# EasyEDA Pro project OpenEarable-PCB-flex-2.0.epro

# Schematic OpenEarable - Earpiece v2.7 - Schematic
Create Date: 2025-03-28; Page Name: OpenEarable - Earpiece v2.5 - Schematic; Project Name: OpenEarable - Earpiece v2.7; Schematic Name: OpenEarable - Earpiece v2.7 - Schematic; Update Date: 2025-03-28; Company: Karlsruhe Institute of Technology; Page Size: A4; Version: V2.0
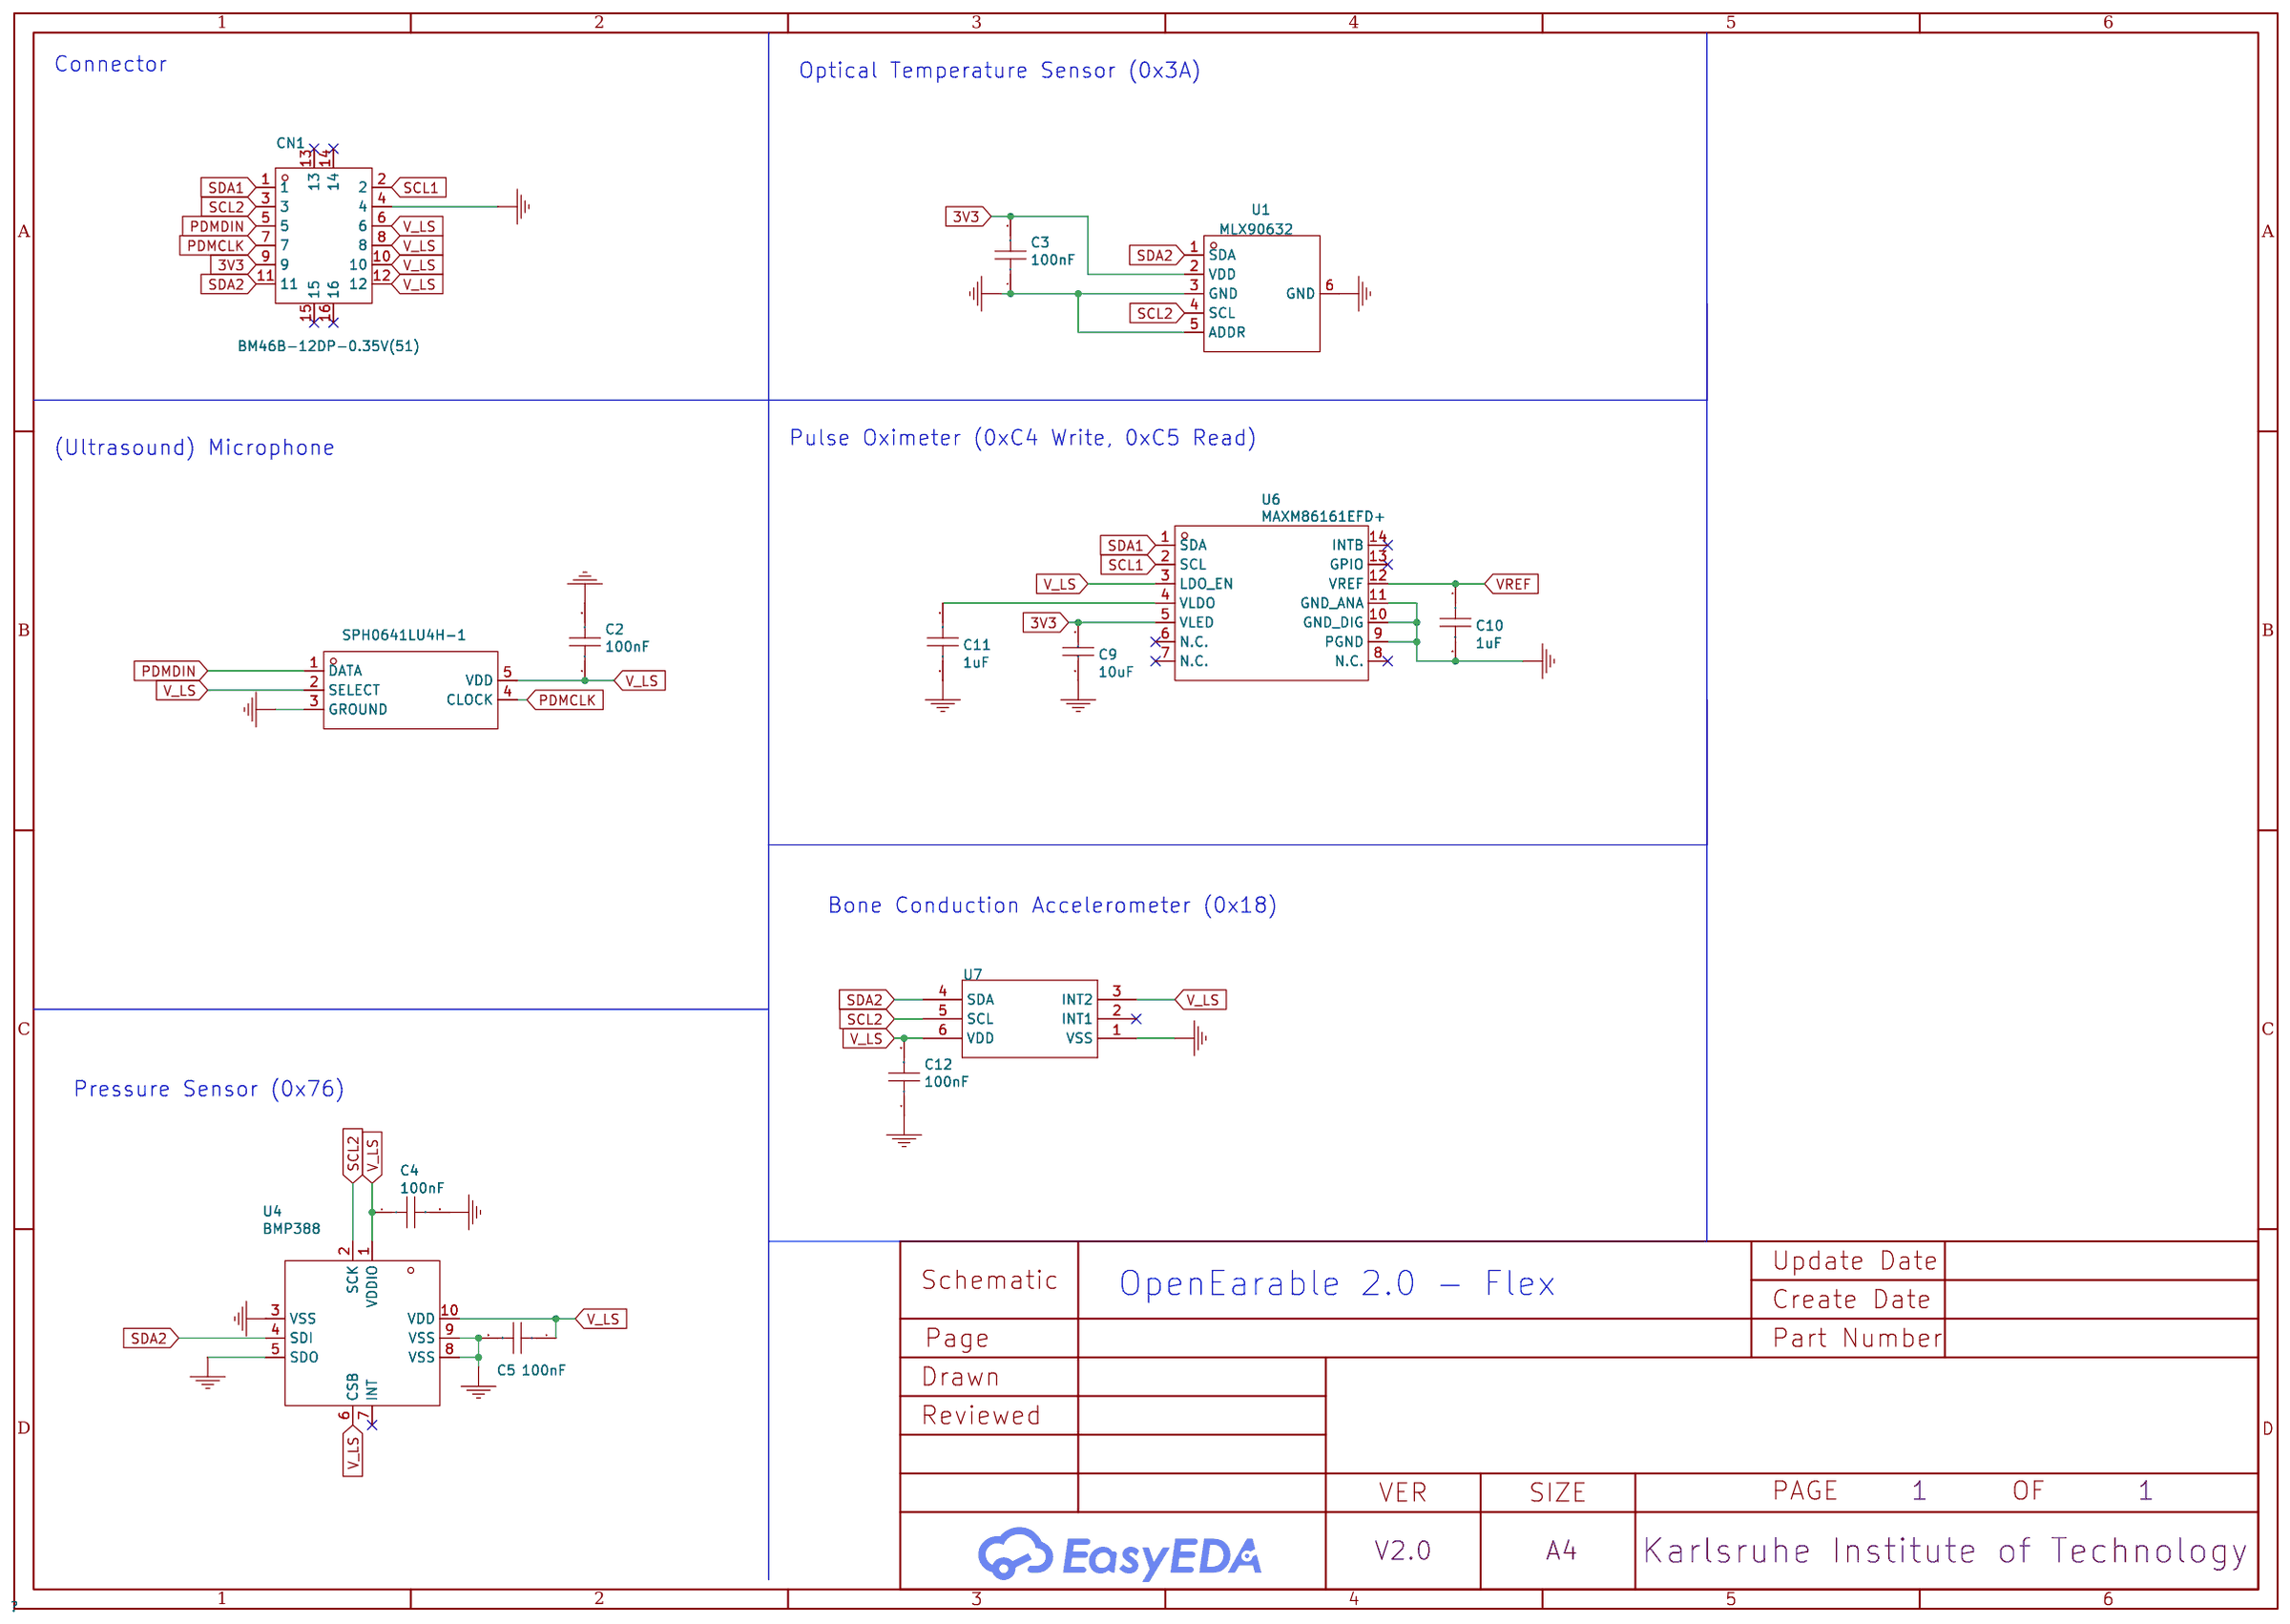
[diagram p0: schematic sheet]

## Parts
C2  100nF  [C0201]
C3  100nF  [C0201]
C4  100nF  [C0201]
C5  100nF  [C0201]
C9  10uF  [C0402]
C10  1uF  [C0201]
C11  1uF  [C0201]
C12  100nF  [C0201]
CN1  BM46B-12DP-0.35V(51)  [CONN-SMD_12P-P0.35_BM46B-12DP-0.35V-51]
U1  MLX90632  [SENSOR-SMD_MLX90632]
U3  SPH0641LU4H-1  [MIC-SMD_5P_L3.5-W2.7-P0.82_SPH0641LU4H-1]
U4  BMP388  [SENSORM-SMD_BMP388]
U6  MAXM86161EFD+  [OLGA-14_L4.3-W2.9-P0.60-TL]
U7  -  [BMA580]

## Library data of the parts
C2-C5 C12 = 100nF: Supplier: LCSC; Supplier Part: C2903664; Manufacturer: CCTC(三环); Manufacturer Part: TCC0201X5R104M6R3ZT
C9 = 10uF: Supplier: LCSC; Manufacturer Part: CL05A106MQ5NUNC; Manufacturer: SAMSUNG(三星); Supplier Part: C15525; JLCPCB Part Class: Basic Part
C10 C11 = 1uF: Supplier: LCSC; Supplier Part: C466604; Manufacturer: SANYEAR(叁叶源); Manufacturer Part: C0201X5R105M6R3NT
CN1 = BM46B-12DP-0.35V(51): Number of Pins:- Pitch:0.35mm Mounting Style:Standing paste Number of Rows:2 Contact Plating:Gold; LCSC Part Name: 间距:0.35mm 公 立贴; Supplier Part: C3642308; Manufacturer: HRS(广濑); Supplier Footprint: SMD,P=0.35mm; JLCPCB Part Class: Extended Part; Datasheet: https://atta.szlcsc.com/upload/public/pdf/source/20241025/0C5D3304AC55DC1CF00DB95F558A8B79.pdf; Supplier: LCSC; Pitch: 0.35mm; Mounting Style: Standing paste; Number of Rows: 2; Contact Plating: Gold
U1 = MLX90632: Supplier: LCSC; Supplier Part: C9900018399; Manufacturer: null; JLCPCB Part Class: Extended Part; link: https://lcsc.com/eda_search?q=C9900018399&amp;%26type=1&amp;ref=editor
U3 = SPH0641LU4H-1: Supplier: LCSC; Supplier Part: C2879853; Manufacturer: null; Manufacturer Part: sph0641lu4h-1; JLCPCB Part Class: Extended Part
U4 = BMP388: Supplier: LCSC; Supplier Part: C779278; Manufacturer: Bosch(博世); JLCPCB Part Class: Extended Part
U6 = MAXM86161EFD+: Supplier: LCSC; Supplier Part: C1530834; Manufacturer: MAXIM(美信); JLCPCB Part Class: Extended Part
U7 = BMA580

## Nets
3V3: C3.2 C9.1 CN1.9 U1.2(VDD) U6.5(VLED)
GND: C2.2 C3.1 C4.2 C5.2 C9.2 C10.2 C11.2 C12.1 CN1.4 U1.3(GND) U1.5(ADDR) U1.6(GND) U3.3(GROUND) U4.3(VSS) U4.5(SDO) U4.8(VSS) U4.9(VSS) U6.9(PGND) U6.10(GND_DIG) U6.11(GND_ANA) U7.1(VSS)
PDMCLK: CN1.7 U3.4(CLOCK)
PDMDIN: CN1.5 U3.1(DATA)
SCL1: CN1.2 U6.2(SCL)
SCL2: CN1.3 U1.4(SCL) U4.2(SCK) U7.5(SCL)
SDA1: CN1.1 U6.1(SDA)
SDA2: CN1.11 U1.1(SDA) U4.4(SDI) U7.4(SDA)
V_LS: C2.1 C4.1 C5.1 C12.2 CN1.6 CN1.8 CN1.10 CN1.12 U3.2(SELECT) U3.5(VDD) U4.1(VDDIO) U4.6(CSB) U4.10(VDD) U6.3(LDO_EN) U7.3(INT2) U7.6(VDD)
VREF: C10.1 U6.12(VREF)
$1N972: C11.1 U6.4(VLDO)

Not connected (* = marked no-connect by the designer): CN1 13* 14* 15* 16*; U4 7(INT)*; U6 6(N.C.)* 7(N.C.)* 8(N.C.)* 13(GPIO)* 14(INTB)*; U7 2(INT1)*

## Notes on the sheet
- Connector
- Optical Temperature Sensor (0x3A)
- (Ultrasound) Microphone
- Pulse Oximeter (0xC4 Write, 0xC5 Read)
- Bone Conduction Accelerometer (0x18)
- Pressure Sensor (0x76)
- OpenEarable 2.0 - Flex

# Board OpenEarable - Earpiece v2.7 - Layout
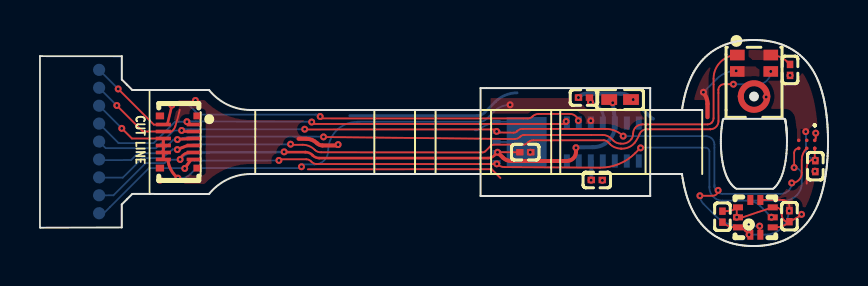
[diagram p1: board, top side]
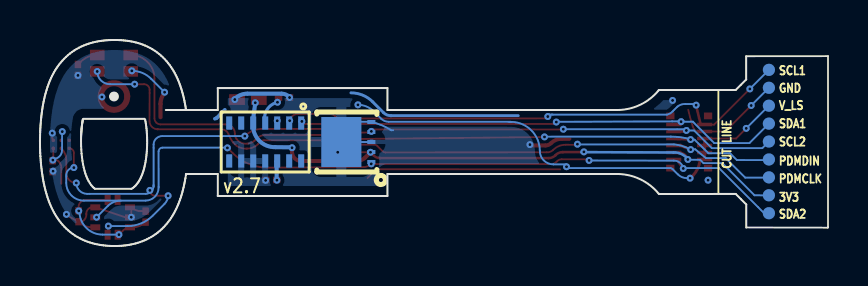
[diagram p2: board, bottom side, seen from below]

Outline 39.42 x 10.31 mm; copper layers: Top Layer, Bottom Layer. Coordinates in mm from the lower left corner of the outline.
Outline path: 5.48,7.8 6.84,7.8 ; 8.46,2.6 6.16,2.6 5.48,2.6 4.62,2.6 4.09,2.08 4.09,0.93 0.02,0.92 0,0.93 0,9.5 4.09,9.5 4.09,8.33 4.62,7.8 8.46,7.8 8.48,7.78 arc(9.4,7.06) 10.54,6.8 22.04,6.8 22.04,7.9 30.53,7.9 30.53,6.8 33.13,6.8 ; 8.45,2.6 8.47,2.62 arc(9.4,3.34) 10.54,3.6 22.04,3.6 22.04,2.5 30.53,2.5 30.53,3.6 32.11,3.6 32.13,3.53 32.12,3.6 ; 32.12,6.8 32.13,6.88 32.14,6.95 32.15,7.03 32.17,7.11 32.18,7.19 32.2,7.27 32.22,7.35 32.24,7.43 32.25,7.51 32.28,7.59 32.3,7.68 32.32,7.76 32.35,7.84 32.37,7.93 32.4,8.01 32.44,8.1 32.47,8.19 32.5,8.28 32.54,8.37 32.59,8.47 32.63,8.56 32.68,8.66 32.74,8.75 32.8,8.85 32.86,8.94 32.93,9.04 33.01,9.14 33.09,9.24 33.17,9.34 33.27,9.43 33.36,9.52 33.46,9.61 33.57,9.69 33.68,9.77 33.8,9.84 33.91,9.91 34.04,9.97 34.16,10.03 34.28,10.07 34.4,10.12 34.51,10.15 34.62,10.18 34.73,10.21 34.84,10.23 34.95,10.25 35.05,10.27 35.15,10.28 35.24,10.29 35.34,10.3 35.43,10.3 35.52,10.3 35.62,10.31 35.71,10.31 35.8,10.31 35.89,10.3 35.98,10.3 36.07,10.29 36.17,10.29 36.26,10.28 36.36,10.26 36.46,10.25 36.56,10.23 36.67,10.21 36.77,10.18 36.88,10.15 37,10.12 37.11,10.08 37.23,10.03 37.34,9.98 37.47,9.92 37.59,9.86 37.7,9.79 37.81,9.71 37.92,9.63 38.02,9.55 38.12,9.46 38.21,9.37 38.3,9.28 38.39,9.18 38.47,9.08 38.54,8.98 38.6,8.88 38.66,8.79 38.72,8.69 38.77,8.6 38.82,8.5 38.87,8.41 38.91,8.32 38.95,8.23 38.98,8.14 39.01,8.05 39.04,7.96 39.07,7.88 39.1,7.79 39.12,7.71 39.15,7.62 39.17,7.54 39.19,7.46 39.21,7.38 39.23,7.3 39.24,7.22 39.26,7.14 39.27,7.06 39.29,6.98 39.3,6.9 39.31,6.82 39.32,6.75 39.34,6.6 39.35,6.52 39.36,6.45 39.37,6.3 39.39,6.15 39.39,6.08 39.4,6 39.4,5.93 39.41,5.78 39.41,5.71 39.42,5.56 39.42,5.42 39.42,5.39 39.42,5.34 39.42,5.28 39.42,5.22 39.42,5.06 39.42,4.98 39.42,4.83 39.41,4.75 39.41,4.67 39.4,4.51 39.39,4.36 39.39,4.28 39.38,4.2 39.37,4.04 39.36,3.96 39.35,3.88 39.34,3.8 39.33,3.72 39.32,3.64 39.31,3.56 39.29,3.48 39.28,3.4 39.27,3.31 39.25,3.23 39.23,3.15 39.22,3.06 39.2,2.97 39.18,2.89 39.15,2.8 39.13,2.71 39.1,2.63 39.08,2.54 39.05,2.45 39.02,2.36 38.99,2.26 38.95,2.17 38.91,2.07 38.87,1.98 38.83,1.88 38.78,1.78 38.72,1.68 38.67,1.58 38.6,1.48 38.54,1.38 38.46,1.27 38.38,1.17 38.3,1.07 38.21,0.97 38.11,0.87 38.01,0.78 37.9,0.69 37.79,0.6 37.67,0.52 37.54,0.45 37.42,0.38 37.29,0.32 37.17,0.26 37.04,0.22 36.92,0.17 36.8,0.14 36.68,0.11 36.57,0.08 36.46,0.06 36.35,0.05 36.24,0.03 36.13,0.02 36.03,0.01 35.93,0.01 35.83,0 35.73,0 35.63,0 35.54,0 35.45,0.01 35.36,0.01 35.26,0.02 35.16,0.03 35.06,0.04 34.96,0.06 34.86,0.08 34.75,0.1 34.64,0.13 34.53,0.16 34.42,0.2 34.3,0.24 34.19,0.28 34.08,0.33 33.97,0.39 33.86,0.45 33.75,0.52 33.65,0.59 33.54,0.67 33.44,0.75 33.34,0.84 33.24,0.93 33.16,1.02 33.08,1.12 33,1.21 32.94,1.3 32.87,1.39 32.81,1.49 32.76,1.58 32.7,1.67 32.66,1.76 32.61,1.85 32.57,1.94 32.53,2.03 32.5,2.11 32.46,2.2 32.43,2.28 32.4,2.37 32.37,2.45 32.35,2.53 32.32,2.61 32.3,2.69 32.28,2.77 32.26,2.85 32.24,2.93 32.22,3.01 32.21,3.08 32.19,3.16 32.18,3.23 32.16,3.31 32.15,3.38 32.14,3.46 ; 34.06,5.23 34.06,5.13 34.06,5.04 34.07,4.94 34.07,4.84 34.08,4.74 34.09,4.65 34.1,4.55 34.11,4.46 34.12,4.36 34.13,4.27 34.15,4.18 34.17,4.09 34.19,4 34.21,3.92 34.23,3.84 34.25,3.75 34.28,3.68 34.3,3.6 34.33,3.53 34.36,3.46 34.4,3.39 34.43,3.32 34.47,3.26 34.5,3.2 34.54,3.15 34.59,3.09 34.64,3.03 34.7,2.97 34.78,2.9 34.85,2.86 36.67,2.86 36.72,2.9 36.79,2.97 36.86,3.05 36.93,3.14 36.99,3.25 37.05,3.36 37.1,3.49 37.15,3.62 37.19,3.77 37.23,3.92 37.27,4.09 37.3,4.26 37.32,4.44 37.34,4.63 37.36,4.82 37.37,5.02 37.37,5.22 37.37,5.31 37.37,5.43 37.36,5.54 37.36,5.6 37.36,5.63 37.36,5.66 37.36,5.68 37.35,5.71 37.35,5.74 37.35,5.79 37.35,5.82 37.34,5.84 37.33,5.95 37.33,5.97 37.33,6.01 37.32,6.07 37.32,6.09 37.31,6.12 37.31,6.14 37.31,6.17 37.3,6.23 37.29,6.28 37.28,6.3 37.28,6.32 37.25,6.36 34.2,6.36 34.16,6.31 34.15,6.23 34.13,6.14 34.12,6.06 34.11,5.97 34.1,5.88 34.09,5.79 34.08,5.7 34.07,5.61 34.07,5.52 34.07,5.42 34.06,5.33 34.06,5.23
Stack: Top Layer 0.012mm / Dielectric1 0.025mm FR4 er 4.5 / Bottom Layer 0.012mm

## Design rules (mm)
template: Custom Config
spacing copperThickness1oz (default): track to track 0.077, other pairs 0.1 to 0.3
spacing copperThickness2oz: track to track 0.203, other pairs 0.152 to 0.3
track width copperThickness1oz (default): min 0.09, default 0.09, max 0.09
track width copperThickness2oz: min 0.203, default 0.254, max 2.54
differential pair differentialPair (default): width min 0.127, default 0.254, max 2.54; gap min 0.152, default 0.152
via viaSize (default): diameter min 0.35, default 0.35, max 0.35; hole min 0.15, default 0.15, max 0.15

## Placement (name value [footprint] x y rotation side)
C2  100nF  [C0201]  37.52 8.81 270 top
C3  100nF  [C0201]  24.28 4.7 180 top
C4  100nF  [C0201]  34.14 1.47 90 top
C5  100nF  [C0201]  37.49 1.49 270 top
C9  10uF  [C0402]  29.02 7.33 0 top
C10  1uF  [C0201]  27.85 3.3 0 top
C11  1uF  [C0201]  27.21 7.43 180 top
C12  100nF  [C0201]  38.79 3.99 90 top
CN1  BM46B-12DP-0.35V(51)  [CONN-SMD_12P-P0.35_BM46B-12DP-0.35V-51]  6.94 5.2 270 top
NOREF  -  [Pad_e529]  2.96 6.12 0 top
NOREF#2  -  [Pad_e534]  2.96 4.33 0 top
NOREF#3  -  [Pad_e535]  2.96 3.43 0 top
NOREF#4  -  [Pad_e533]  2.96 5.23 0 top
NOREF#5  -  [Pad_e531]  2.96 8.81 0 top
NOREF#6  -  [Pad_e528]  2.96 7.02 0 top
NOREF#7  -  [Pad_e536]  2.96 2.54 0 top
NOREF#8  -  [Pad_e537]  2.96 1.64 0 top
NOREF#9  -  [Pad_e524]  2.96 7.92 0 top
U1  MLX90632  [sensor-smd_mlx90632]  23.6 5.2 90 bottom
U3  SPH0641LU4H-1  [MIC-SMD_5P_L3.5-W2.7-P0.82_SPH0641LU4H-1]  35.72 8.19 0 top
U4  BMP388  [SENSORM-SMD_BMP388]  35.79 1.43 180 top
U6  MAXM86161EFD+  [olga-14_l4.3-w2.9-p0.60-tl]  28.16 5.2 270 bottom
U7  -  [BMA580]  38.36 5.09 0 top

## Footprints (pads in the part's own frame, mm; a bottom-side part is the same pattern mirrored in y, then rotated)
BMA580
  round 0.18 smd: 1(0.4,0.2) 2(0,0.2) 3(-0.4,0.2) 4(-0.4,-0.2) 5(0,-0.2) 6(0.4,-0.2)
C0201
  rect 0.368x0.324 smd: 1(-0.275,0) 2(0.275,0)
C0402
  rect 0.79x0.54 smd: 1(-0.545,0) 2(0.545,0)
CONN-SMD_12P-P0.35_BM46B-12DP-0.35V-51
  rect 0.18x0.755 smd: 1(-0.875,0.772) 2(-0.875,-0.772) 3(-0.525,0.772) 4(-0.525,-0.772) 5(-0.175,0.772) 6(-0.175,-0.772) 7(0.175,0.772) 8(0.175,-0.772) 9(0.525,0.772) 10(0.525,-0.772) 11(0.875,0.772) 12(0.875,-0.772)
  rect 0.34x0.415 smd: 13(1.305,0.943) 14(1.305,-0.943) 15(-1.305,0.943) 16(-1.305,-0.943)
MIC-SMD_5P_L3.5-W2.7-P0.82_SPH0641LU4H-1
  rect 0.73x0.53 smd: 1(-0.838,1.369) 2(-0.838,0.546) 4(0.838,0.546) 5(0.838,1.369)
  custom 1.626x0.963 smd: 3(0,-0.043)
  custom 1.626x0.966 smd: 6(0,-1.368)
olga-14_l4.3-w2.9-p0.60-tl
  rect 0.66x0.3 smd: 1(-0.95,1.8) 2(-0.95,1.2) 3(-0.95,0.6) 4(-0.95,0) 5(-0.95,-0.6) 6(-0.95,-1.2) 7(-0.95,-1.8) 8(0.95,-1.8) 9(0.95,-1.2) 10(0.95,-0.6) 11(0.95,0) 12(0.95,0.6) 13(0.95,1.2) 14(0.95,1.8)
Pad_e524
  round 0.61 smd far side: TP2(0,0)
Pad_e528
  round 0.61 smd far side: TP3(0,0)
Pad_e529
  round 0.61 smd far side: TP4(0,0)
Pad_e531
  round 0.61 smd far side: TP1(0,0)
Pad_e533
  round 0.61 smd far side: TP5(0,0)
Pad_e534
  round 0.61 smd far side: TP6(0,0)
Pad_e535
  round 0.61 smd far side: TP7(0,0)
Pad_e536
  round 0.61 smd far side: TP8(0,0)
Pad_e537
  round 0.61 smd far side: TP9(0,0)
sensor-smd_mlx90632
  rect 0.2x0.4 smd: 1(-1,-0.75) 2(-0.499,-0.75) 3(0,-0.75) 4(0.5,-0.75) 5(1,-0.75)
  rect 2.5x2 smd: 6(0,0.75)
SENSORM-SMD_BMP388
  rect 0.3x0.5 smd: 1(0.25,0.871) 2(-0.25,0.871) 6(-0.25,-0.871) 7(0.25,-0.871)
  rect 0.5x0.3 smd: 3(-0.87,0.5) 4(-0.87,0) 5(-0.87,-0.5) 8(0.869,-0.5) 9(0.869,0) 10(0.869,0.5)

## Nets
3V3: C3.2 C9.1 CN1.9 NOREF#7.TP8 U1.2 U6.5
GND: C2.2 C3.1 C4.2 C5.2 C9.2 C10.2 C11.2 C12.1 CN1.4 NOREF#9.TP2 U1.3 U1.5 U1.6 U3.3 U3.6 U4.3 U4.5 U4.8 U4.9 U6.9 U6.10 U6.11 U7.1
PDMCLK: CN1.7 NOREF#3.TP7 U3.4
PDMDIN: CN1.5 NOREF#2.TP6 U3.1
SCL1: CN1.2 NOREF#5.TP1 U6.2
SCL2: CN1.3 NOREF#4.TP5 U1.4 U4.2 U7.5
SDA1: CN1.1 NOREF.TP4 U6.1
SDA2: CN1.11 NOREF#8.TP9 U1.1 U4.4 U7.4
V_LS: C2.1 C4.1 C5.1 C12.2 CN1.6 CN1.8 CN1.10 CN1.12 NOREF#6.TP3 U3.2 U3.5 U4.1 U4.6 U4.10 U6.3 U7.3 U7.6
VREF: C10.1 U6.12
$1N972: C11.1 U6.4

Pads without a net: CN1 13 14 15 16; U4 7; U6 6 7 8 13 14; U7 2

## Via types
v1: diameter 0.35, hole 0.15, Top Layer to Bottom Layer, 59 vias

## Routing (per net, layer and track width the routed paths; a pad name or vN(x,y) marks a point on that pad's centre or on a via; arc(x,y) is an arc through that point)
3V3: length 31.2
  Top Layer w0.09: v1(22.89,4.69) 24,4.69 arc(24,4.69) C3.2
  Top Layer w0.127: 7.01,4.35 arc(7.21,4.59) 7.51,4.68 ; 12.25,4.7 13.31,4.7 ; 13.26,4.7 13.28,4.7 arc(13.46,4.66) 13.62,4.55 13.64,4.54 arc(13.79,4.43) 13.98,4.4 ; 13.97,4.4 22.42,4.4 arc(22.58,4.43) 22.72,4.53 v1(22.89,4.69)
  Top Layer w0.2: v1(22.89,4.69) 23.16,4.42 arc(23.35,4.3) 23.57,4.25 26.36,4.25 arc(26.68,4.39) 26.81,4.71 26.81,4.94
  Bottom Layer w0.09: 2.96,2.53 3.68,2.54 5.28,4.14 6.23,4.14 6.4,4.31 7.01,4.31
  Bottom Layer w0.127: 7.01,4.35 arc(7.34,4.6) 7.74,4.68 ; CN1.9 12.33,4.7
  Bottom Layer w0.2: 26.81,4.94 27.65,4.95 arc(28.48,5.29) U6.5 arc(28.73,6.28) 28.75,6.41 v1(28.65,7.17)
  vias: v1(7.01,4.33) v1(12.21,4.71) v1(26.81,4.92)
GND:
  vias: v1(3.84,7.03) v1(6,3.29) v1(7.78,7.28) v1(14.91,5.07) v1(24.53,4.69) v1(26.94,7.43) v1(28.13,3.28) v1(29.68,7.33) v1(34.86,1.44) v1(36.33,7.46) v1(37.52,8.53) v1(38.1,1.58) v1(38.81,5.65) v1(38.77,3.74)
PDMCLK: length 38
  Top Layer w0.09: 12.49,5.06 13.13,5.07 arc(13.46,5) 13.75,4.81 arc(13.89,4.71) 14.07,4.69 22.14,4.68 arc(22.22,4.7) 22.28,4.74 22.55,5 arc(22.62,5.05) 22.71,5.07 24.16,5.07 ; 24.16,5.07 arc(24.29,5.09) 24.4,5.17 24.41,5.18 arc(24.53,5.26) 24.67,5.29 28.21,5.29 arc(28.32,5.27) 28.4,5.21 28.51,5.1 arc(28.76,4.93) 29.07,4.87 29.08,4.87 arc(29.45,4.94) 29.75,5.17 arc(29.89,5.38) 30,5.6 arc(30.13,5.77) 30.34,5.84 30.41,5.84 33.53,5.84 ; 33.53,5.84 arc(33.53,5.84) 33.53,5.84 33.53,5.84 ; 33.53,5.84 33.53,5.84 arc(33.82,5.96) 33.94,6.25 33.94,7.65 33.94,7.81 arc(34.02,8.01) 34.22,8.09 v1(34.69,8.09)
  Top Layer w0.15: 6.93,4.85 7.39,5.03
  Bottom Layer w0.09: 2.96,3.42 4.14,3.42 5.12,4.4 6.11,4.4 6.64,4.84 6.94,4.84 ; 6.93,4.85 arc(7.31,5.01) 7.71,5.08 12.61,5.08 ; v1(34.69,8.09) 35.92,8.09 arc(36.37,8.28) v1(36.56,8.73)
  vias: v1(6.87,4.82) v1(12.54,5.09)
PDMDIN: length 37
  Top Layer w0.09: 14.18,5.45 23.75,5.35 ; 23.75,5.36 arc(23.89,5.38) 24.01,5.46 24.03,5.48 arc(24.11,5.53) 24.21,5.55 24.25,5.55 ; 24.25,5.56 27.58,5.56 28.14,5.56 arc(28.38,5.51) 28.58,5.38 ; 28.58,5.38 28.68,5.28 arc(28.85,5.16) 29.05,5.12 arc(29.35,5.16) 29.58,5.35 arc(29.65,5.48) 29.67,5.63 arc(29.81,5.95) 30.13,6.08 30.36,6.08 ; 30.29,6.08 33.41,6.08 ; 33.39,6.08 arc(33.51,6.11) 33.61,6.17 arc(33.67,6.27) 33.7,6.39 33.7,8.37 arc(34.04,9.21) U3.1
  Top Layer w0.15: 6.83,5.37 6.89,5.34 CN1.5
  Bottom Layer w0.09: 2.96,4.3 4.56,4.3 4.9,4.64 5.98,4.64 6.68,5.32 6.88,5.32 ; 6.88,5.33 6.89,5.34 arc(7.37,5.44) 7.87,5.47 ; 7.86,5.47 14.31,5.47
  vias: v1(6.88,5.33) v1(14.18,5.46)
SCL1:
  vias: v1(3.91,7.86) v1(6.6,7.05) v1(14.02,6.48) v1(26.93,6.27)
SCL2:
  vias: v1(7.09,5.78) v1(13.24,5.84) v1(22.85,5.73) v1(29.18,5.5) v1(33.01,2.51) v1(33.93,2.78) v1(36,1) v1(37.61,3.15)
SDA1: length 24.8
  Top Layer w0.09: 7.69,6.08 CN1.1 ; 13.65,6.11 26.36,6.11
  Top Layer w0.15: 7.35,6.21 7.53,6.08 7.78,6.08
  Bottom Layer w0.09: NOREF.TP4 3.93,5.15 5.69,5.15 6.76,6.22 v1(7.35,6.22) arc(7.37,6.23) 7.38,6.23 7.79,6.23 13.66,6.21
  vias: v1(13.59,6.2) v1(26.32,6.23)
SDA2:
  vias: v1(7.24,3.88) v1(11.95,4.28) v1(22.85,4.11) v1(30.05,4.91) v1(36.59,1.44) v1(37.73,3.92)
V_LS:
  vias: v1(4.09,5.89) v1(6.9,3.39) v1(13.08,3.97) v1(23.52,7.06) v1(27.56,6.27) v1(33.19,7.69) v1(34.83,8.76) v1(35.47,0.57) v1(37.48,1.76) v1(38.31,5.72) v1(38.78,4.3)
VREF: length 0.9
  Bottom Layer w0.2: 27.59,3.3 27.59,4.23 arc(27.59,4.23) 27.59,4.23
  vias: v1(27.57,3.29)
$1N972: length 1.4
  Bottom Layer w0.15: v1(27.54,7.19) 27.55,7.19 arc(28.08,6.8) U6.4

## Copper pours and planes (outline as drawn; the poured copper is in the pictures)
GND on Top Layer: 5.48,2.6 8.45,2.6 8.89,3.03 9.4,3.34 10.16,3.57 10.54,3.6 11.81,3.62 14.41,6.8 10.47,6.8 9.81,6.93 9.01,7.29 8.46,7.8 5.48,7.8
GND on Bottom Layer: 5.48,2.6 8.45,2.6 8.87,3.01 9.4,3.34 10.21,3.6 22.04,3.6 22.04,2.5 30.53,2.5 30.53,3.6 32.12,3.6 32.43,2.28 32.73,1.63 33.16,1.02 33.86,0.45 34.75,0.1 35.78,0 36.68,0.11 37.61,0.49 38.25,1.02 38.83,1.88 39.2,2.97 39.37,4.12 39.42,5.42 39.32,6.75 39.04,7.96 38.66,8.79 38.17,9.42 37.53,9.89 36.77,10.18 35.8,10.31 34.79,10.22 33.85,9.88 33.13,9.29 32.63,8.56 32.3,7.68 32.12,6.8 30.53,6.8 30.53,7.9 22.04,7.9 22.04,6.8 10.21,6.8 9.4,7.06 8.9,7.37 8.46,7.8 5.48,7.8
V_LS on Top Layer: 12.44,3.6 22.04,3.6 22.04,2.5 30.53,2.5 30.53,3.6 32.12,3.6 32.35,2.53 32.66,1.76 33.08,1.12 33.7,0.55 34.42,0.2 35.06,0.04 35.73,0 36.57,0.08 37.42,0.38 38.06,0.83 38.57,1.43 39.05,2.45 39.3,3.52 39.41,4.67 39.37,6.3 39.17,7.54 38.72,8.69 38.21,9.37 37.53,9.89 36.67,10.21 35.8,10.31 35.15,10.28 34.45,10.13 33.85,9.88 33.27,9.43 32.68,8.66 32.3,7.68 32.12,6.8 30.53,6.8 30.53,7.9 22.04,7.9 22.04,4.22 12.45,4.22

## Text on the board
Bottom Silkscreen Layer: CUT LINE | SCL1 | GND | V_LS | SDA1 | SCL2 | PDMDIN | PDMCLK | 3V3 | SDA2 | v2.7
Top Silkscreen Layer: CUT LINE
